# Altium project WeatherStation.PrjPcb
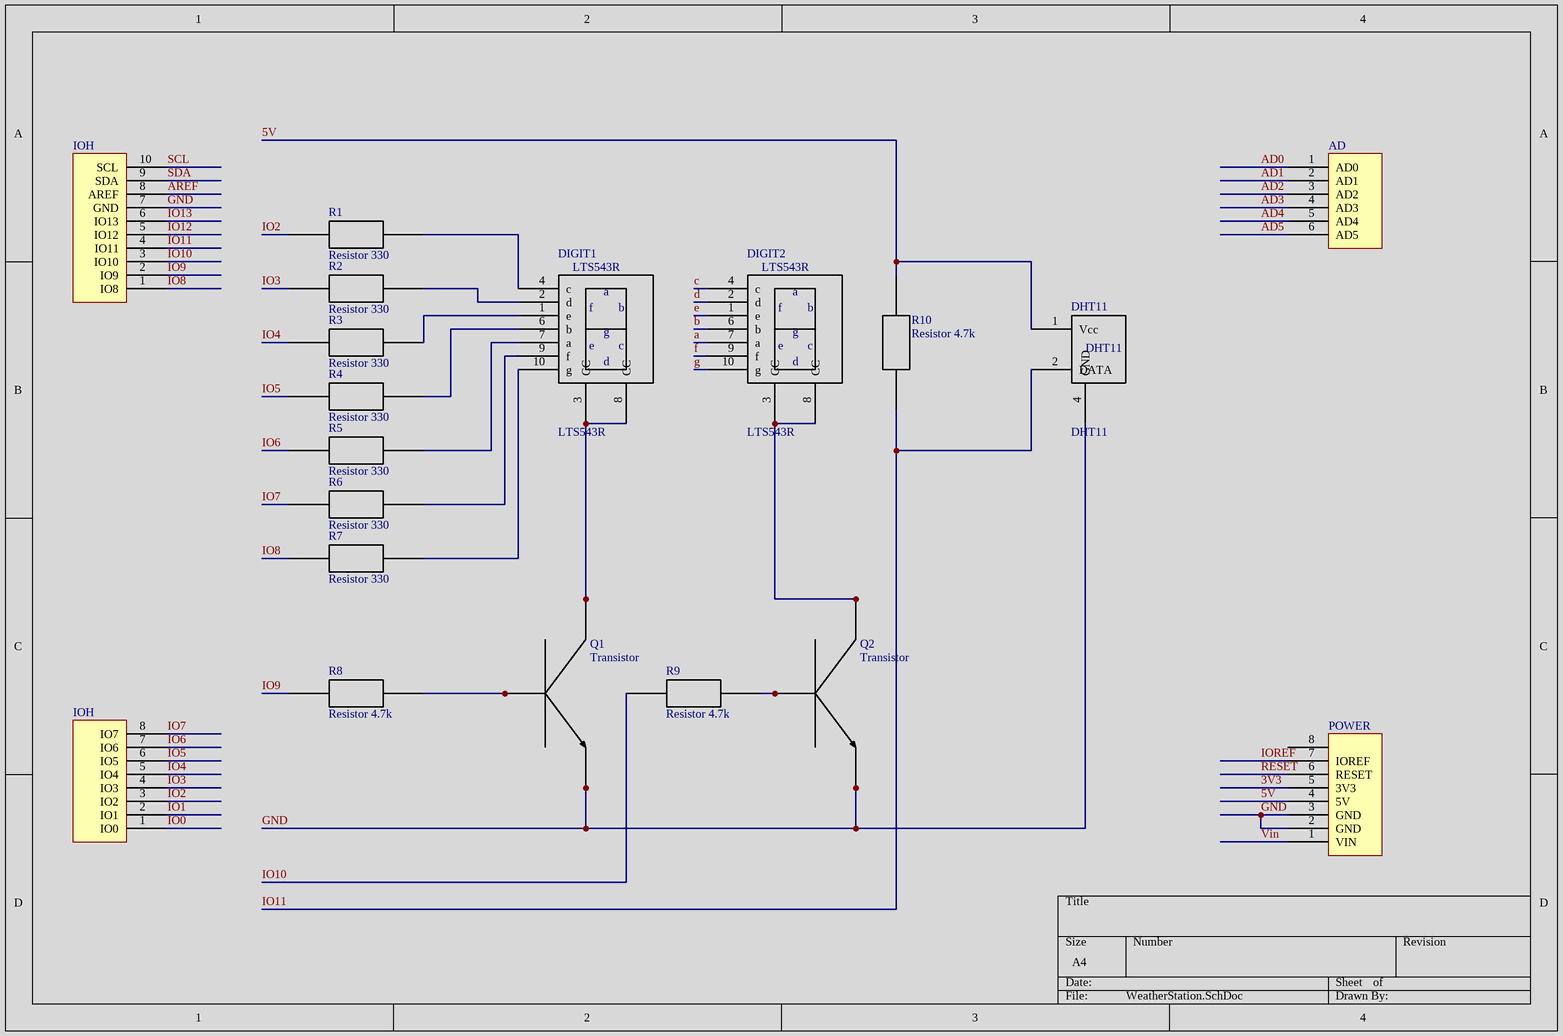
[diagram p0: WeatherStation.SchDoc]
1 sheet, 19 parts. Net scope: global (net labels, ports and power ports of the same name join across sheets).
Board file: WeatherStation.PcbDoc

## Sheet WeatherStation.SchDoc
size A4; SheetNumber: 1; SheetTotal: 1

### Parts
AD  AD  [AD]  (value not drawn)
DHT11  DHT11  [DHT11]
DIGIT1  LTS543R  [7SEGMENT]
DIGIT2  LTS543R  [7SEGMENT]
IOH_1  IOH 1  [IOH 1]  (value not drawn)
IOH_2  IOH 2  [IOH 2]  (value not drawn)
POWER  POWER  [POWER]  (value not drawn)
Q1  Transistor  [TRANSISTOR]
Q2  Transistor  [TRANSISTOR]
R1  Resistor 330  [RESISTOR]
R2  Resistor 330  [RESISTOR]
R3  Resistor 330  [RESISTOR]
R4  Resistor 330  [RESISTOR]
R5  Resistor 330  [RESISTOR]
R6  Resistor 330  [RESISTOR]
R7  Resistor 330  [RESISTOR]
R8  Resistor 4.7k  [RESISTOR]
R9  Resistor 4.7k  [RESISTOR]
R10  Resistor 4.7k  [RESISTOR]

### Nets
3V3: POWER.5(3V3)
5V: DHT11.1(Vcc) POWER.4(5V) R10.2
a: DIGIT2.7(a)
AD0: AD.1(AD0)
AD1: AD.2(AD1)
AD2: AD.3(AD2)
AD3: AD.4(AD3)
AD4: AD.5(AD4)
AD5: AD.6(AD5)
AREF: IOH_1.8(AREF)
b: DIGIT2.6(b)
c: DIGIT2.4(c)
d: DIGIT2.2(d)
e: DIGIT2.1(e)
f: DIGIT2.9(f)
g: DIGIT2.10(g)
GND: DHT11.4(GND) IOH_1.7(GND) POWER.2(GND) POWER.3(GND) Q1.5 Q2.5
IO0: IOH_2.1(IO0)
IO1: IOH_2.2(IO1)
IO2: IOH_2.3(IO2) R1.1
IO3: IOH_2.4(IO3) R2.1
IO4: IOH_2.5(IO4) R3.1
IO5: IOH_2.6(IO5) R4.1
IO6: IOH_2.7(IO6) R5.1
IO7: IOH_2.8(IO7) R6.1
IO8: IOH_1.1(IO8) R7.1
IO9: IOH_1.2(IO9) R8.1
IO10: IOH_1.3(IO10) R9.1
IO11: DHT11.2(DATA) IOH_1.4(IO11) R10.1
IO12: IOH_1.5(IO12)
IO13: IOH_1.6(IO13)
IOREF: POWER.7(IOREF)
RESET: POWER.6(RESET)
SCL: IOH_1.10(SCL)
SDA: IOH_1.9(SDA)
Vin: POWER.1(VIN)
NetDIGIT1_1: DIGIT1.1(e) R3.2
NetDIGIT1_2: DIGIT1.2(d) R2.2
NetDIGIT1_3: DIGIT1.3(CC) DIGIT1.8(CC) Q1.7
NetDIGIT1_4: DIGIT1.4(c) R1.2
NetDIGIT1_6: DIGIT1.6(b) R4.2
NetDIGIT1_7: DIGIT1.7(a) R5.2
NetDIGIT1_9: DIGIT1.9(f) R6.2
NetDIGIT1_10: DIGIT1.10(g) R7.2
NetDIGIT2_3: DIGIT2.3(CC) DIGIT2.8(CC) Q2.7
NetQ1_6: Q1.6 R8.2
NetQ2_6: Q2.6 R9.2

Not connected (* = marked no-connect by the designer): POWER 8

### Notes on the sheet
- (in symbol IOH 1) IOH
- (in symbol IOH 2) IOH